# Altium schematic sheet Example.SchDoc
size A; SheetNumber: 1; SheetTotal: 1
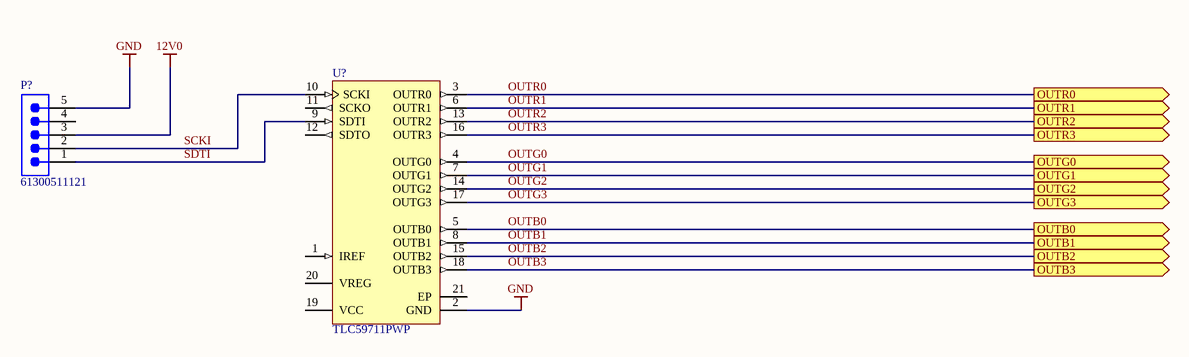
[diagram p0: Example.SchDoc]

## Parts
P?  61300511121  [61300511121]
U?  TLC59711PWP  [PWP0020P_M]

## Ports
OUTB0 (out), OUTB1 (out), OUTB2 (out), OUTB3 (out), OUTG0 (out), OUTG1 (out), OUTG2 (out), OUTG3 (out), OUTR0 (out), OUTR1 (out), OUTR2 (out), OUTR3 (out)

## Nets
12V0: P?.3
GND: P?.5 U?.2(GND)
OUTB0: U?.5(OUTB0) ; port OUTB0
OUTB1: U?.8(OUTB1) ; port OUTB1
OUTB2: U?.15(OUTB2) ; port OUTB2
OUTB3: U?.18(OUTB3) ; port OUTB3
OUTG0: U?.4(OUTG0) ; port OUTG0
OUTG1: U?.7(OUTG1) ; port OUTG1
OUTG2: U?.14(OUTG2) ; port OUTG2
OUTG3: U?.17(OUTG3) ; port OUTG3
OUTR0: U?.3(OUTR0) ; port OUTR0
OUTR1: U?.6(OUTR1) ; port OUTR1
OUTR2: U?.13(OUTR2) ; port OUTR2
OUTR3: U?.16(OUTR3) ; port OUTR3
SCKI: P?.2 U?.10(SCKI)
SDTI: P?.1 U?.9(SDTI)

Not connected (* = marked no-connect by the designer): P? 4; U? 1(IREF) 11(SCKO) 12(SDTO) 19(VCC) 20(VREG) 21(EP)

## Library data of the parts
P? = CMP-1502-01068-3: NexarPartId: 32855526; Connector Type: Male Pin; Gender: Male; Contact Resistance: 20mΩ; Pitch: 2.54mm; Operating Supply Voltage: 250V; Current Rating: 3A; Number of Contacts: 5; Lead Free: Lead Free; Color: Black; Packaging: Bulk; Lead Pitch: 2.54mm; Contact Material: Copper; Min Operating Temperature: -40°C; Contact Mating Length: 5.9944mm; Voltage Rating: 250V; Number of Pins: 5; Number of Positions: 5; Height: 8.89mm; Orientation: Vertical; REACH SVHC: Unknown; RoHS: Compliant; Contact Plating: Gold; Max Operating Temperature: 105°C; Mount: Through Hole; Number of Rows: 1; Termination: Solder
U? = CMP-0388-00426-2: 12-Channel, 16-Bit, ES-PWM RGB LED Driver with 3.3 V Linear Regulator and Watchdog Timer, 4 to 17 V, -40 to 85 degC, 20-pin SOP (PWP20), Green (RoHS & no Sb/Br); Manufacturer: Texas Instruments; Dimming: TRUE; Iout(Max)(A): 0.075; Vin(Max)(V): 17; Rating: Catalog; Vin(Min)(V): 4; ComponentLink3URL: http://www.ti.com/litv/pdf/mhts001g; SubFamily: LED Driver; ComponentLink2URL: http://www.ti.com/general/docs/lit/getliterature.tsp?genericPartNumber=TLC59711&fileType=pdf; PackageReference: PWP0020P; PartNumber: TLC59711PWP; Code_JEDEC: MO-153; ComponentLink2Description: Datasheet; Mounting Technology: Surface Mount; Eco-Plan: Green (RoHS & no Sb/Br); PackageDescription: 20-Lead, Plastic Small Outline, Body Size 4.4 x 6.5 mm, Pitch 0.65 mm; ComponentLink3Description: Package Specification; DatasheetVersion: SBVS181A; ComponentLink1URL: http://www.ti.com/; PackageVersion: 4073225-4/I; ComponentLink1Description: Manufacturer URL